# Altium schematic sheet MainMux.SchDoc
size A4
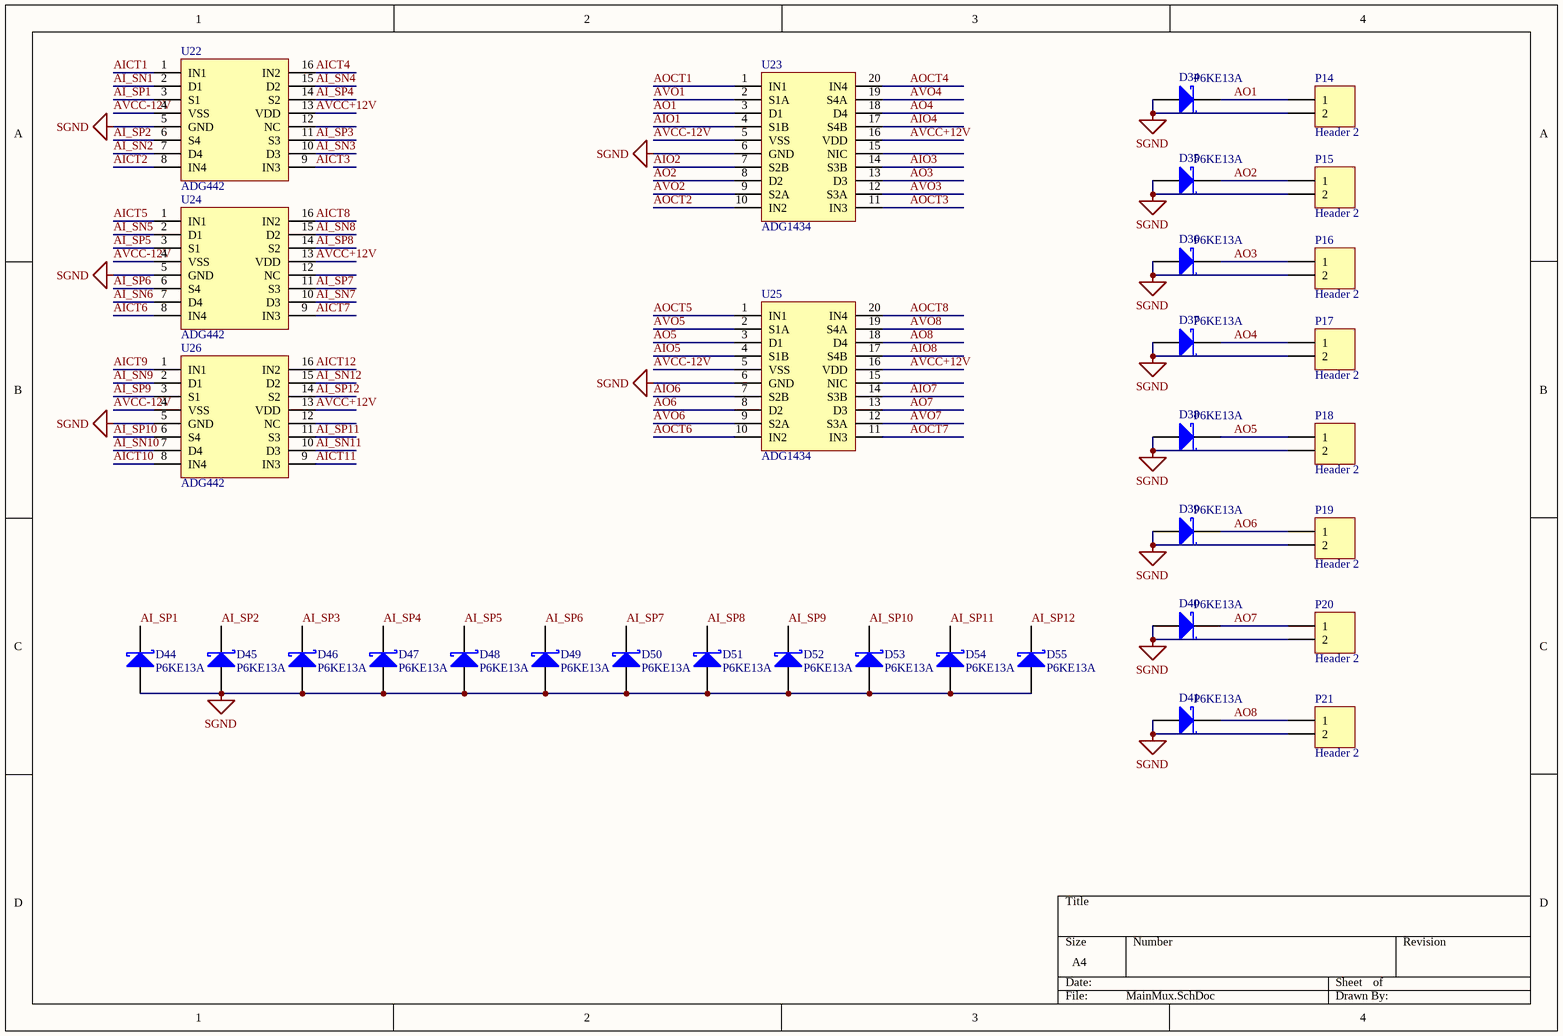
[diagram p0: MainMux.SchDoc]

## Parts
D34  P6KE13A  [SMB]
D35  P6KE13A  [SMB]
D36  P6KE13A  [SMB]
D37  P6KE13A  [SMB]
D38  P6KE13A  [SMB]
D39  P6KE13A  [SMB]
D40  P6KE13A  [SMB]
D41  P6KE13A  [SMB]
D44  P6KE13A  [SMB]
D45  P6KE13A  [SMB]
D46  P6KE13A  [SMB]
D47  P6KE13A  [SMB]
D48  P6KE13A  [SMB]
D49  P6KE13A  [SMB]
D50  P6KE13A  [SMB]
D51  P6KE13A  [SMB]
D52  P6KE13A  [SMB]
D53  P6KE13A  [SMB]
D54  P6KE13A  [SMB]
D55  P6KE13A  [SMB]
P14  Header 2  [JIEKE_2PX508]
P15  Header 2  [JIEKE_2PX508]
P16  Header 2  [JIEKE_2PX508]
P17  Header 2  [JIEKE_2PX508]
P18  Header 2  [JIEKE_2PX508]
P19  Header 2  [JIEKE_2PX508]
P20  Header 2  [JIEKE_2PX508]
P21  Header 2  [JIEKE_2PX508]
U22  ADG442  [SOIC127P600-16M]
U23  ADG1434  [TSSOP20]
U24  ADG442  [SOIC127P600-16M]
U25  ADG1434  [TSSOP20]
U26  ADG442  [SOIC127P600-16M]

## Nets
SGND: D34.1(A) D35.1(A) D36.1(A) D37.1(A) D38.1(A) D39.1(A) D40.1(A) D41.1(A) D44.1(A) D45.1(A) D46.1(A) D47.1(A) D48.1(A) D49.1(A) D50.1(A) D51.1(A) D52.1(A) D53.1(A) D54.1(A) D55.1(A) P14.2 P15.2 P16.2 P17.2 P18.2 P19.2 P20.2 P21.2 U22.5(GND) U23.6(GND) U24.5(GND) U25.6(GND) U26.5(GND)
AI_SN1: U22.2(D1)
AI_SN2: U22.7(D4)
AI_SN3: U22.10(D3)
AI_SN4: U22.15(D2)
AI_SN5: U24.2(D1)
AI_SN6: U24.7(D4)
AI_SN7: U24.10(D3)
AI_SN8: U24.15(D2)
AI_SN9: U26.2(D1)
AI_SN10: U26.7(D4)
AI_SN11: U26.10(D3)
AI_SN12: U26.15(D2)
AI_SP1: D44.2(K) U22.3(S1)
AI_SP2: D45.2(K) U22.6(S4)
AI_SP3: D46.2(K) U22.11(S3)
AI_SP4: D47.2(K) U22.14(S2)
AI_SP5: D48.2(K) U24.3(S1)
AI_SP6: D49.2(K) U24.6(S4)
AI_SP7: D50.2(K) U24.11(S3)
AI_SP8: D51.2(K) U24.14(S2)
AI_SP9: D52.2(K) U26.3(S1)
AI_SP10: D53.2(K) U26.6(S4)
AI_SP11: D54.2(K) U26.11(S3)
AI_SP12: D55.2(K) U26.14(S2)
AICT1: U22.1(IN1)
AICT2: U22.8(IN4)
AICT3: U22.9(IN3)
AICT4: U22.16(IN2)
AICT5: U24.1(IN1)
AICT6: U24.8(IN4)
AICT7: U24.9(IN3)
AICT8: U24.16(IN2)
AICT9: U26.1(IN1)
AICT10: U26.8(IN4)
AICT11: U26.9(IN3)
AICT12: U26.16(IN2)
AIO1: U23.4(S1B)
AIO2: U23.7(S2B)
AIO3: U23.14(S3B)
AIO4: U23.17(S4B)
AIO5: U25.4(S1B)
AIO6: U25.7(S2B)
AIO7: U25.14(S3B)
AIO8: U25.17(S4B)
AO1: D34.2(K) P14.1 U23.3(D1)
AO2: D35.2(K) P15.1 U23.8(D2)
AO3: D36.2(K) P16.1 U23.13(D3)
AO4: D37.2(K) P17.1 U23.18(D4)
AO5: D38.2(K) P18.1 U25.3(D1)
AO6: D39.2(K) P19.1 U25.8(D2)
AO7: D40.2(K) P20.1 U25.13(D3)
AO8: D41.2(K) P21.1 U25.18(D4)
AOCT1: U23.1(IN1)
AOCT2: U23.10(IN2)
AOCT3: U23.11(IN3)
AOCT4: U23.20(IN4)
AOCT5: U25.1(IN1)
AOCT6: U25.10(IN2)
AOCT7: U25.11(IN3)
AOCT8: U25.20(IN4)
AVCC+12V: U22.13(VDD) U23.16(VDD) U24.13(VDD) U25.16(VDD) U26.13(VDD)
AVCC-12V: U22.4(VSS) U23.5(VSS) U24.4(VSS) U25.5(VSS) U26.4(VSS)
AVO1: U23.2(S1A)
AVO2: U23.9(S2A)
AVO3: U23.12(S3A)
AVO4: U23.19(S4A)
AVO5: U25.2(S1A)
AVO6: U25.9(S2A)
AVO7: U25.12(S3A)
AVO8: U25.19(S4A)

Not connected (* = marked no-connect by the designer): U22 12(NC); U23 15(NIC); U24 12(NC); U25 15(NIC); U26 12(NC)

## Library data of the parts
D34-D41 D44-D55 = D Schottky: Schottky Diode; Published: 8-Jun-2000; LatestRevisionDate: 17-Jul-2002; LatestRevisionNote: Re-released for DXP Platform.; PackageReference: SMB; Publisher: Altium Limited; Code_JEDEC: DO-214-AA
P14-P21 = Header 2: Header, 2-Pin; LatestRevisionDate: 17-Jul-2002; LatestRevisionNote: Re-released for DXP Platform.; Publisher: Altium Limited
U22 U24 U26 = ADG441-AD
U23 U25 = ADG